# EAGLE design DIGISPARK_PRODUCTION_REV3 (EAGLE 8.0.0)
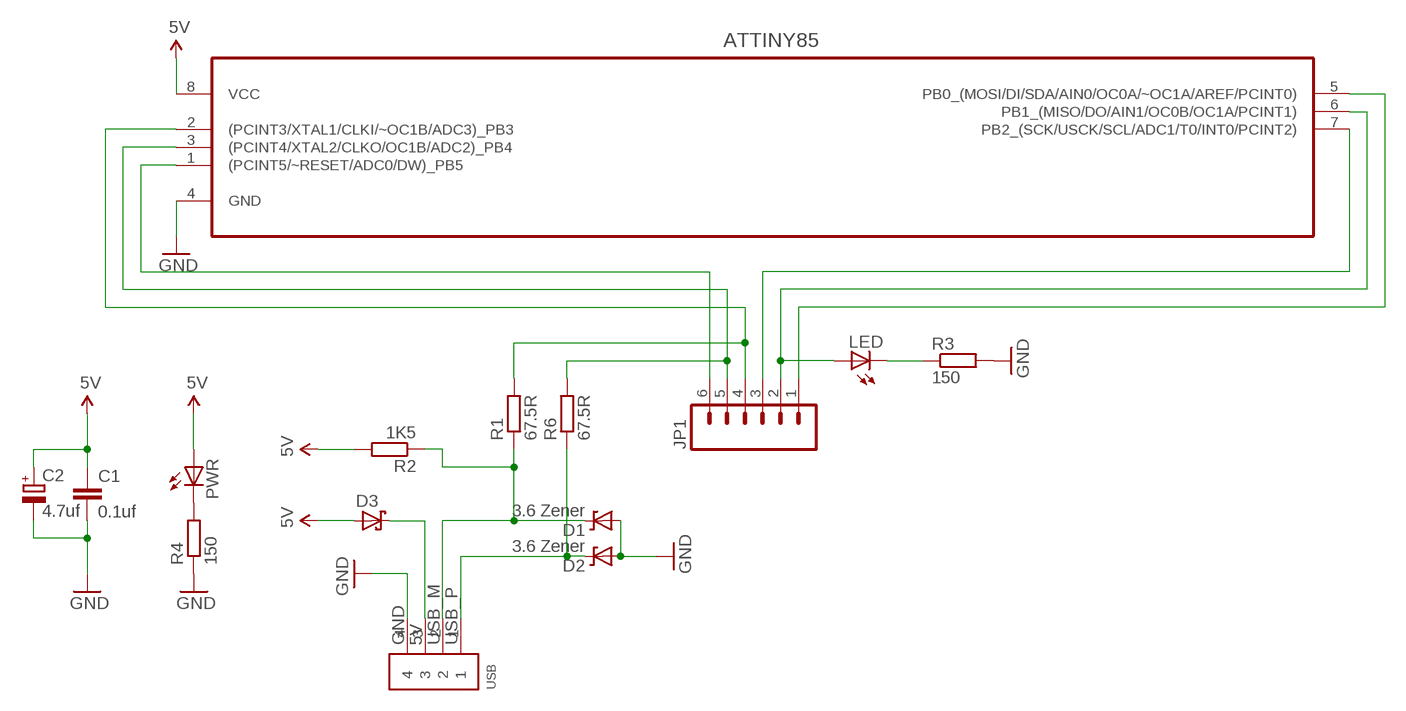
[diagram p0: schematic, sheet 1]

## Parts
ATTINY85  ATTINY85-20PU  [DIP254P762X533-8]
C1  0.1uf  C-EU050-045X075  [C050-045X075]
C2  4.7uf  CPOL-EUE5-4  [E5-4]
D1  3.6 Zener  DIODE-ZENERPTH  [DIODE-ZENER]
D2  3.6 Zener  DIODE-ZENERPTH  [DIODE-ZENER]
D3  SCHOTTKY-DIODEDO35-7  [DO35-7]
JP1  M06SIP  [1X06]
LED  LED5MM  [LED5MM]
PWR  LED5MM  [LED5MM]
R1  67.5R  R-EU_0207/12  [0207/12]
R2  1K5  R-EU_0207/12  [0207/12]
R3  150  R-EU_0207/12  [0207/12]
R4  150  R-EU_0207/12  [0207/12]
R6  67.5R  R-EU_0207/12  [0207/12]
USB  1X4-CLEANBIG  [1X04-CLEANBIG]

## Nets
5V: ATTINY85.8(VCC) C1.1 C2.+ D3.A PWR.A R2.2
GND: ATTINY85.4(GND) C1.2 C2.- D1.P$2(A) D2.P$2(A) R3.2 R4.1 USB.4
N$1: PWR.K(C) R4.2
N$2: ATTINY85.6(PB1_(MISO/DO/AIN1/OC0B/OC1A/PCINT1)) JP1.2 LED.A
N$4: LED.K(C) R3.1
N$9: ATTINY85.1((PCINT5/~RESET/ADC0/DW)_PB5) JP1.6
N$10: D1.P$1(C) R1.1 R2.1 USB.2
N$11: D2.P$1(C) R6.1 USB.1
N$13: ATTINY85.2((PCINT3/XTAL1/CLKI/~OC1B/ADC3)_PB3) JP1.4 R1.2
N$14: ATTINY85.7(PB2_(SCK/USCK/SCL/ADC1/T0/INT0/PCINT2)) JP1.3
N$15: ATTINY85.3((PCINT4/XTAL2/CLKO/OC1B/ADC2)_PB4) JP1.5 R6.2
N$16: D3.C USB.3
N$17: ATTINY85.5(PB0_(MOSI/DI/SDA/AIN0/OC0A/~OC1A/AREF/PCINT0)) JP1.1

## Library data of the parts
ATTINY85 = Atmel_By_element14_Batch_1-00:ATTINY85-20PU: 8-bit Microcontroller with In-System Programmable Flash; MPN: ATTINY85-20PU; OC_FARNELL: 1455162; OC_NEWARK: 58M3796; PACKAGE: PDIP-8; SUPPLIER: Atmel
C1 = rcl:C-EU: CAPACITOR, European symbol
C2 = rcl:CPOL-EU: POLARIZED CAPACITOR, European symbol
D1 D2 = Johnboiles:DIODE-ZENER: Zener Diode Production Part - 8199 3.4V Zener Voltage
D3 = adafruit:SCHOTTKY-DIODE: Schottky Diode
JP1 = SparkFun:M06: Header 6 Standard 6-pin 0.1" header. Use with straight break away headers (SKU : PRT-00116), right angle break away headers (PRT-00553), swiss pins (PRT-00743), machine pins (PRT-00117), and female headers (PRT-00115). Molex polarized connector foot print use with SKU : PRT-08094 with associated crimp pins and housings. NOTES ON THE VARIANTS LOCK and LOCK_LONGPADS... This footprint was designed to help hold the alignment of a through-hole component (i.e. 6-pin header) while soldering it into place. You may notice that each hole has been shifted either up or down by 0.005 of an inch from it's more standard position (which is a perfectly straight line). This slight alteration caused the pins (the squares in the middle) to touch the edges of the holes. Because they are alternating, it causes a "brace" to hold the component in place. 0.005 has proven to be the perfect amount of "off-center" position when using our standard breakaway headers. Although looks a little odd when you look at the bare footprint, once you have a header in there, the alteration is very hard to notice. Also, if you push a header all the way into place, it is covered up entirely on the bottom side. This idea of altering the position of holes to aid alignment will be further integrated into the Sparkfun Library for other footprints. It can help hold any component with 3 or more connection pins.; OC_FARNELL: unknown
LED PWR = led:LED: LED OSRAM: - CHIPLED LG R971, LG N971, LY N971, LG Q971, LY Q971, LO R971, LY R971 LH N974, LH R974 LS Q976, LO Q976, LY Q976 LO Q996 - Hyper CHIPLED LW Q18S LB Q993, LB Q99A, LB R99A - SideLED LS A670, LO A670, LY A670, LG A670, LP A670 LB A673, LV A673, LT A673, LW A673 LH A674 LY A675 LS A676, LA A676, LO A676, LY A676, LW A676 LS A679, LY A679, LG A679 - Hyper Micro SIDELED® LS Y876, LA Y876, LO Y876, LY Y876 LT Y87S - SmartLED LW L88C, LW L88S LB L89C, LB L89S, LG L890 LS L89K, LO L89K, LY L89K LS L896, LA L896, LO L896, LY L896 - TOPLED LS T670, LO T670, LY T670, LG T670, LP T670 LSG T670, LSP T670, LSY T670, LOP T670, LYG T670 LG T671, LOG T671, LSG T671 LB T673, LV T673, LT T673, LW T673 LH T674 LS T676, LA T676, LO T676, LY T676, LB T676, LH T676, LSB T676, LW T676 LB T67C, LV T67C, LT T67C, LS T67K, LO T67K, LY T67K, LW E67C LS E67B, LA E67B, LO E67B, LY E67B, LB E67C, LV E67C, LT E67C LW T67C LS T679, LY T679, LG T679 LS T770, LO T770, LY T770, LG T770, LP T770 LB T773, LV T773, LT T773, LW T773 LH T774 LS E675, LA E675, LY E675, LS T675 LS T776, LA T776, LO T776, LY T776, LB T776 LHGB T686 LT T68C, LB T68C - Hyper Mini TOPLED® LB M676 - Mini TOPLED Santana® LG M470 LS M47K, LO M47K, LY M47K Source: http://www.osram.convergy.de LUXEON: - LUMILED® LXK2-PW12-R00, LXK2-PW12-S00, LXK2-PW14-U00, LXK2-PW14-V00 LXK2-PM12-R00, LXK2-PM12-S00, LXK2-PM14-U00 LXK2-PE12-Q00, LXK2-PE12-R00, LXK2-PE12-S00, LXK2-PE14-T00, LXK2-PE14-U00 LXK2-PB12-K00, LXK2-PB12-L00, LXK2-PB12-M00, LXK2-PB14-N00, LXK2-PB14-P00, LXK2-PB14-Q00 LXK2-PR12-L00, LXK2-PR12-M00, LXK2-PR14-Q00, LXK2-PR14-R00 LXK2-PD12-Q00, LXK2-PD12-R00, LXK2-PD12-S00 LXK2-PH12-R00, LXK2-PH12-S00 LXK2-PL12-P00, LXK2-PL12-Q00, LXK2-PL12-R00 Source: www.luxeon.com KINGBRIGHT: KA-3528ASYC Source: www.kingbright.com
R1-R4 R6 = rcl:R-EU_: RESISTOR, European symbol
USB = adafruit:1X4: 4-pin connector; 1: GND; 2: 5V; 3: USB_M; 4: USB_P

## Board
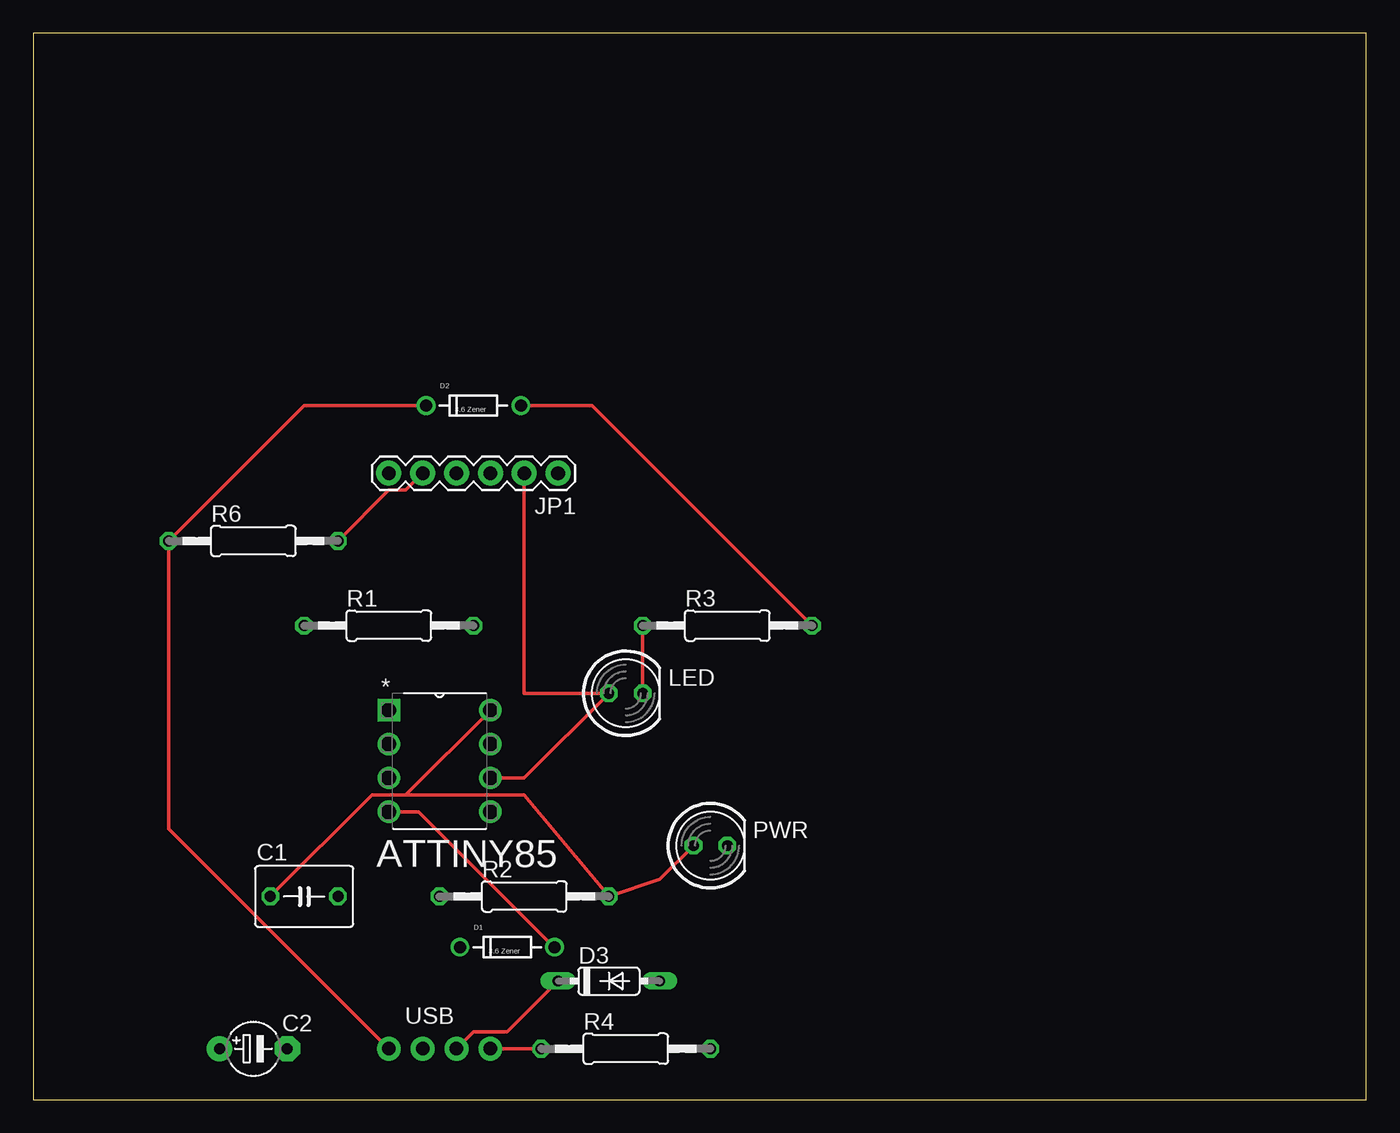
[diagram p1: board, top side]
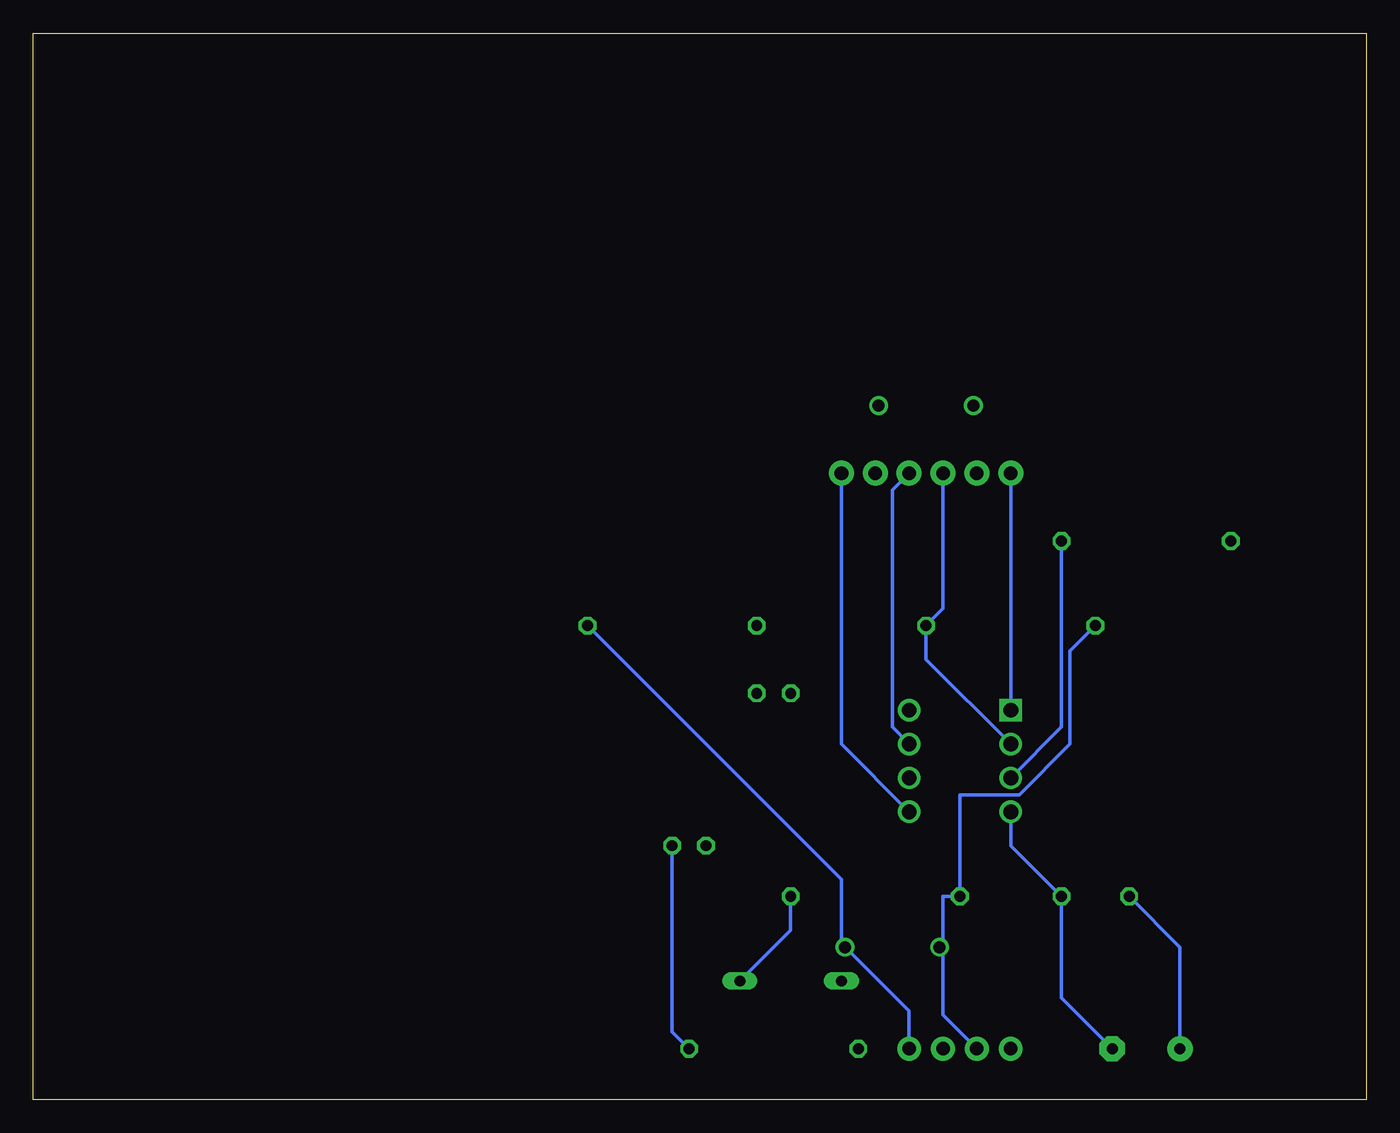
[diagram p2: board, bottom side, seen from below]

Size 100 x 80 mm. Coordinates in mm from the lower left corner, seen from the top.
Outline: 0,0 100,0 100,80 0,80 0,0
Copper layers (1*16): Top 0.035mm / dielectric 1.5mm / Bottom 0.035mm
Design rules "default": minimum track width 10mil, minimum drill 24mil, track to track 8mil, track to pad 8mil, pad to pad 8mil, via to via 8mil, smd to smd 8mil, copper to edge 40mil, drill to drill 8mil, minimum pad ring 10mil, minimum via ring 8mil, stop-mask expansion 4mil, vias tented up to drill 0mil, thermal gap 10mil

### Footprints (pad centres in the part's own frame; a part is rotated, then mirrored left to right if it is on the bottom)
DIP254P762X533-8 = drill 1.118 square: 1 -7.62,7.62 | drill 1.118: 2 -7.62,5.08; 3 -7.62,2.54; 4 -7.62,0; 5 0,0; 6 0,2.54; 7 0,5.08; 8 0,7.62
C050-045X075 = drill 0.813 octagon: 1 -2.54,0; 2 2.54,0
E5-4 = drill 0.813 pad 1.905: + -2.54,0 | drill 0.813 pad 1.905 octagon: - 2.54,0
DIODE-ZENER = drill 0.9: P$1 -3.556,0; P$2 3.556,0
DO35-7 = drill 0.813 long: A 3.81,0; C -3.81,0
1X06 = drill 1.016 pad 1.88: 1 0,0; 2 2.54,0; 3 5.08,0; 4 7.62,0; 5 10.16,0; 6 12.7,0
LED5MM = drill 0.813 octagon: A -1.27,0; K 1.27,0
0207/12 = drill 0.813 octagon: 1 -6.35,0; 2 6.35,0
1X04-CLEANBIG = drill 1.016 pad 1.778: 1 -3.81,0; 2 -1.27,0; 3 1.27,0; 4 3.81,0

### Placement (x,y rotation side)
ATTINY85  34.29,21.59 0 top
C1  20.32,15.24 0 top
C2  16.51,3.81 0 top
D1  35.56,11.43 0 top
D2  33.02,52.07 0 top
D3  43.18,8.89 0 top
JP1  39.37,46.99 180 top
LED  44.45,30.48 0 top
PWR  50.8,19.05 0 top
R1  26.67,35.56 0 top
R2  36.83,15.24 0 top
R3  52.07,35.56 0 top
R4  44.45,3.81 0 top
R6  16.51,41.91 0 top
USB  30.48,3.81 0 top

### Tracks (layer width: path | path; a pad name or v marks a point on that pad's centre or on a via)
5V
  Top 0.254: PWR.A 46.99,16.51 R2.2 36.83,22.86 27.94,22.86 | 27.94,22.86 ATTINY85.8 | 27.94,22.86 25.4,22.86 C1.1
  Bottom 0.254: D3.A 43.18,12.7 R2.2 | C1.1 13.97,11.43 C2.+
GND
  Top 0.254: R3.2 41.91,52.07 D2.P$2 | USB.4 R4.1 | ATTINY85.4 28.89,21.59 39.05,11.43 D1.P$2
  Bottom 0.254: USB.4 34.29,6.67 39.05,11.43 D1.P$2 39.37,11.43 39.37,16.51 R3.2 | ATTINY85.4 26.67,19.05 C1.2 22.86,7.62 C2.-
N$1
  Bottom 0.254: R4.2 52.07,5.08 PWR.K
N$2
  Top 0.254: ATTINY85.6 36.83,24.13 LED.A 36.83,30.48 JP1.2
N$4
  Top 0.254: R3.1 LED.K
N$9
  Bottom 0.254: JP1.6 ATTINY85.1
N$10
  Bottom 0.254: 31.75,11.43 31.75,15.24 R2.1 30.48,22.86 26.04,22.86 22.23,26.67 22.23,33.66 R1.1 | USB.2 31.75,6.35 31.75,11.43 | 31.75,11.43 D1.P$1
N$11
  Top 0.254: D2.P$1 20.32,52.07 R6.1 10.16,20.32 USB.1
N$13
  Bottom 0.254: JP1.4 31.75,36.83 R1.2 33.02,33.02 ATTINY85.2
N$14
  Bottom 0.254: ATTINY85.7 35.56,27.94 35.56,45.72 JP1.3
N$15
  Top 0.254: R6.2 26.67,45.72 27.94,45.72 JP1.5
  Bottom 0.254: ATTINY85.3 22.86,27.94 R6.2
N$16
  Top 0.254: D3.C 35.56,5.08 33.02,5.08 USB.3
N$17
  Bottom 0.254: ATTINY85.5 39.37,26.67 JP1.1